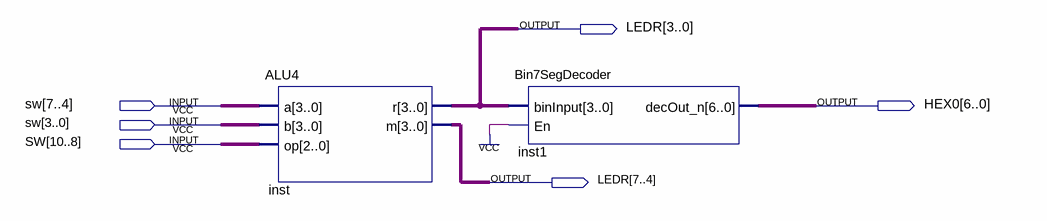
[diagram p0: schematic sheet]
// Quartus schematic ALUDemo.bdf as structural Verilog: 2 symbols, 6 pins
module ALUDemo (
  input  [10:0] sw,
  output [7:0] LEDR,
  output [6:0] HEX0
);

  ALU4 inst (.a(sw[7:4]), .b(sw[3:0]), .op(sw[10:8]), .r(LEDR[3:0]), .m(LEDR[7:4]));
  Bin7SegDecoder inst1 (.binInput(LEDR[3:0]), .En(1'b1), .decOut_n(HEX0));
endmodule
